# Altium schematic sheet elevator.SchDoc
size A2
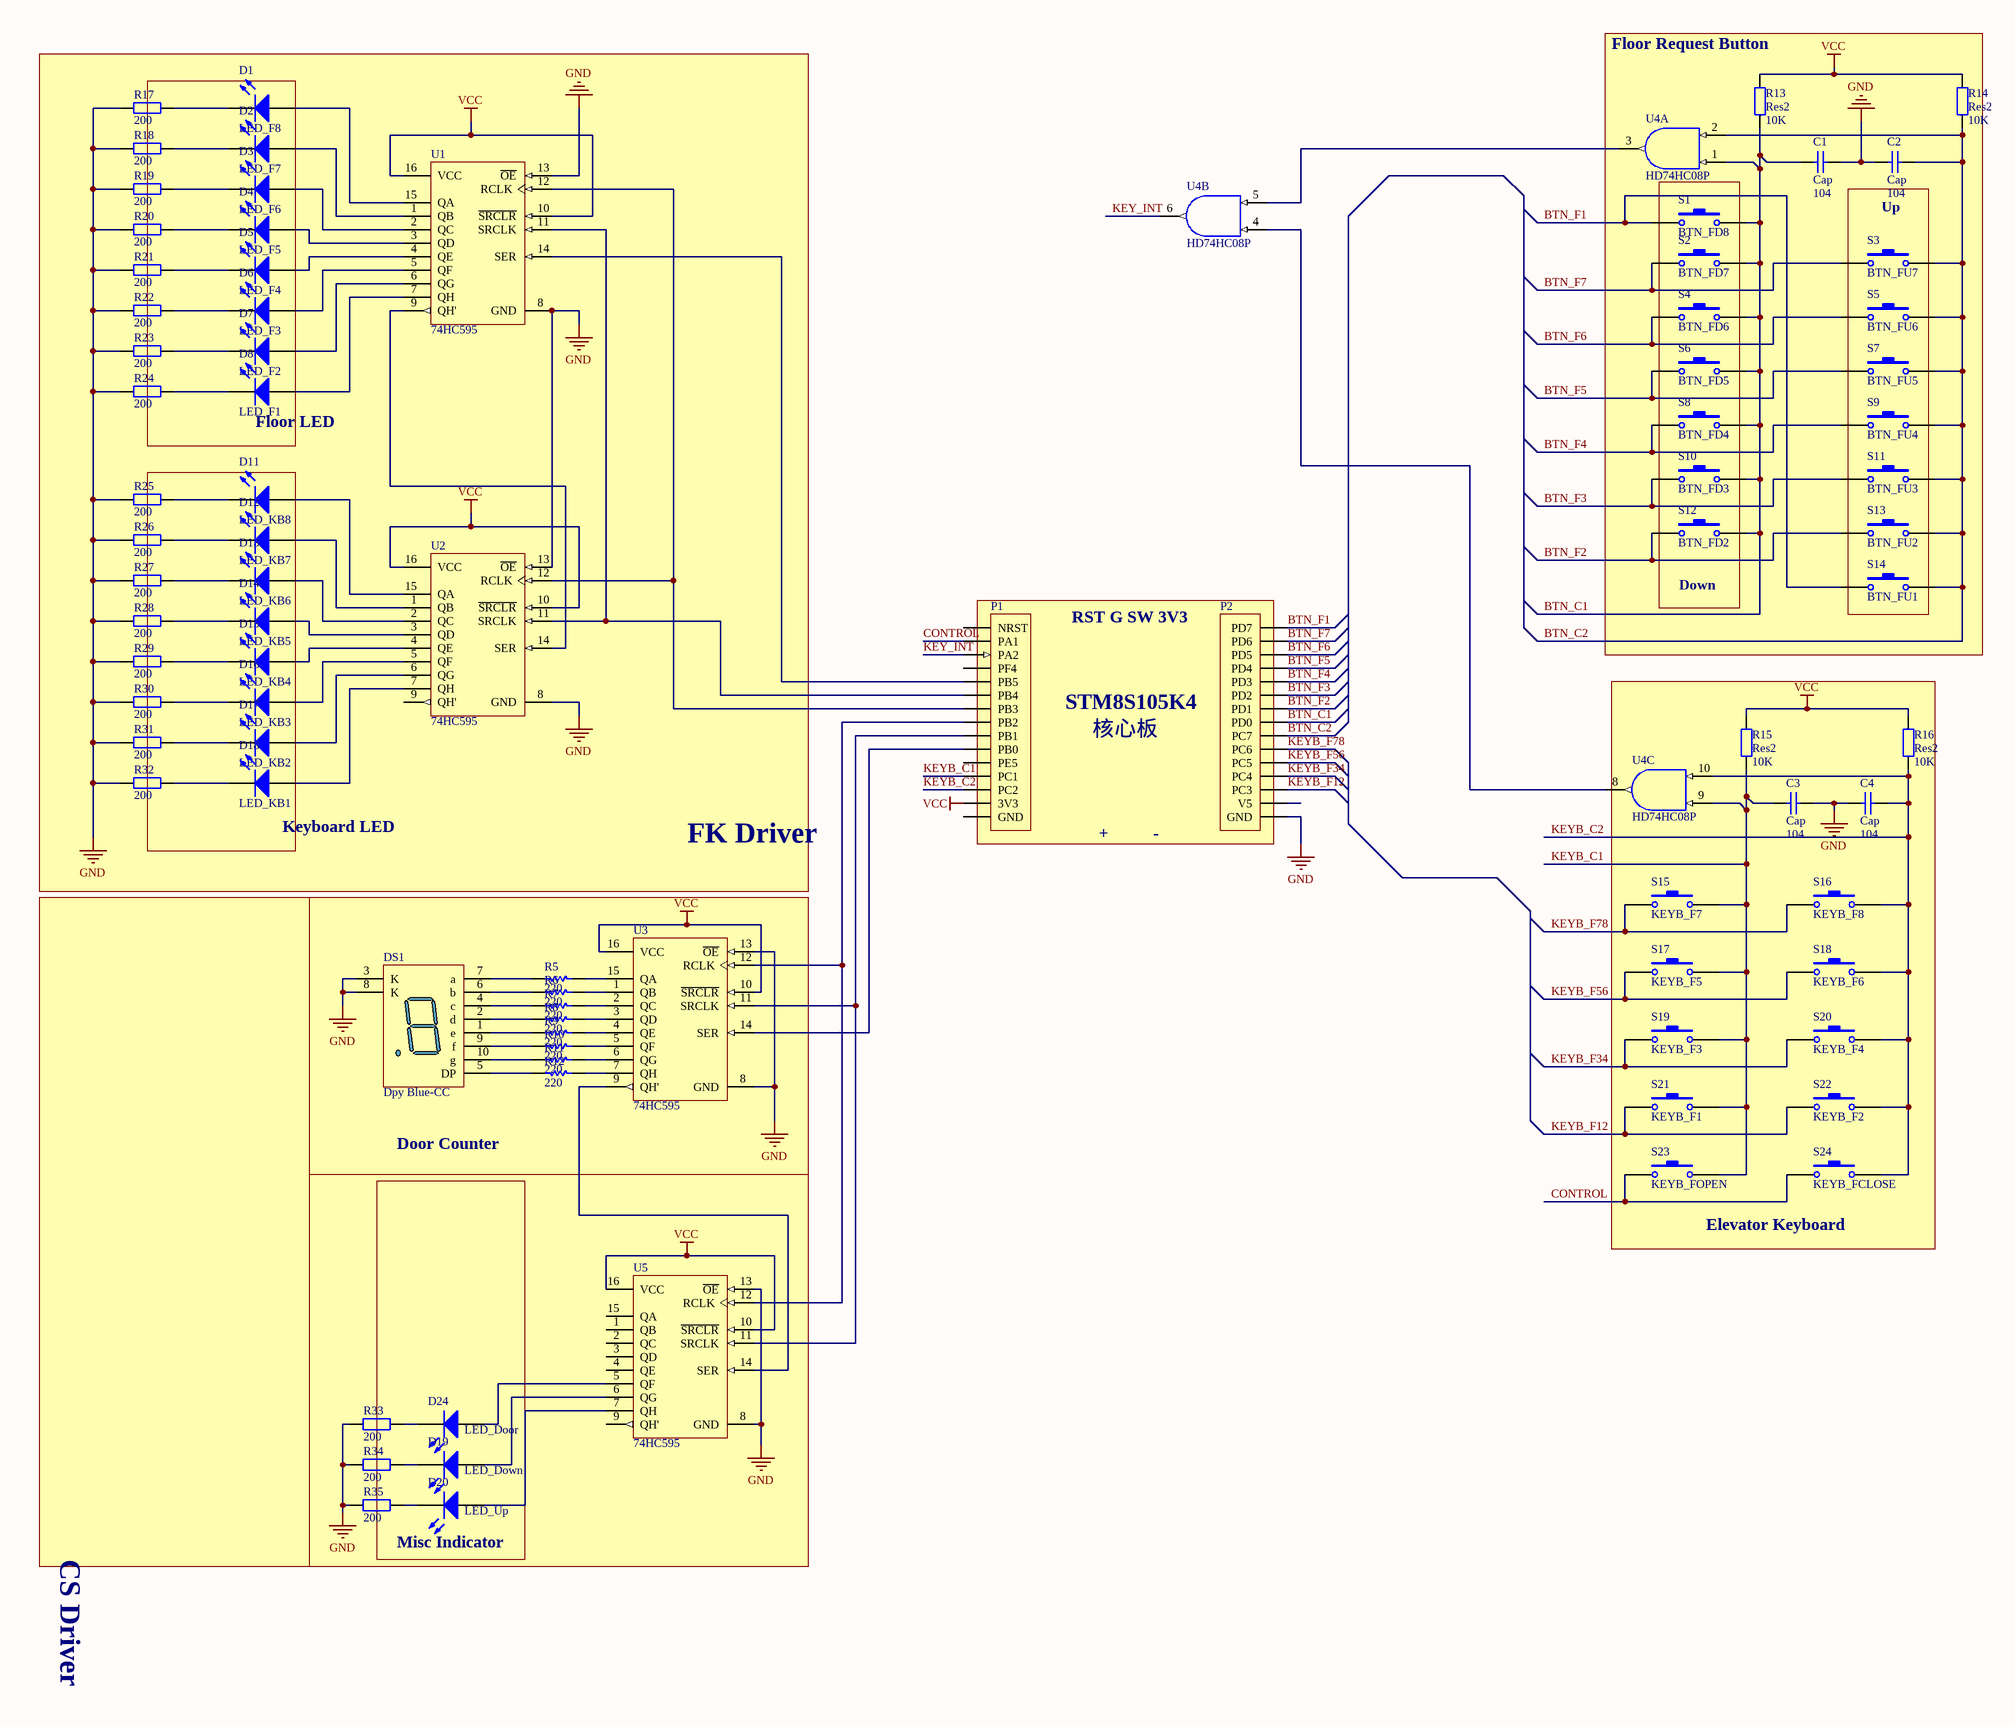
[diagram p0: elevator.SchDoc]

## Parts
C1  Cap  value 104  [RAD-0.3]
C2  Cap  value 104  [RAD-0.3]
C3  Cap  value 104  [RAD-0.3]
C4  Cap  value 104  [RAD-0.3]
D1  LED_F8  [LED-0]
D2  LED_F7  [LED-0]
D3  LED_F6  [LED-0]
D4  LED_F5  [LED-0]
D5  LED_F4  [LED-0]
D6  LED_F3  [LED-0]
D7  LED_F2  [LED-0]
D8  LED_F1  [LED-0]
D11  LED_KB8  [LED-0]
D12  LED_KB7  [LED-0]
D13  LED_KB6  [LED-0]
D14  LED_KB5  [LED-0]
D15  LED_KB4  [LED-0]
D16  LED_KB3  [LED-0]
D17  LED_KB2  [LED-0]
D18  LED_KB1  [LED-0]
D19  LED_Down  [LED-0]
D20  LED_Up  [LED-0]
D24  LED_Door  [LED-0]
DS1  Dpy Blue-CC  [H]
P1  (no value)  [HDR1X15H]
P2  (no value)  [HDR1X15H]
R5  value 220  [6-0805_N]  (hidden comment: Res1)
R6  value 220  [6-0805_N]  (hidden comment: Res1)
R7  value 220  [6-0805_N]  (hidden comment: Res1)
R8  value 220  [6-0805_N]  (hidden comment: Res1)
R9  value 220  [6-0805_N]  (hidden comment: Res1)
R10  value 220  [6-0805_N]  (hidden comment: Res1)
R11  value 220  [6-0805_N]  (hidden comment: Res1)
R12  value 220  [6-0805_N]  (hidden comment: Res1)
R13  Res2  value 10K  [AXIAL-0.4]
R14  Res2  value 10K  [AXIAL-0.4]
R15  Res2  value 10K  [AXIAL-0.4]
R16  Res2  value 10K  [AXIAL-0.4]
R17  value 200  [AXIAL-0.4]  (hidden comment: Res2)
R18  value 200  [AXIAL-0.4]  (hidden comment: Res2)
R19  value 200  [AXIAL-0.4]  (hidden comment: Res2)
R20  value 200  [AXIAL-0.4]  (hidden comment: Res2)
R21  value 200  [AXIAL-0.4]  (hidden comment: Res2)
R22  value 200  [AXIAL-0.4]  (hidden comment: Res2)
R23  value 200  [AXIAL-0.4]  (hidden comment: Res2)
R24  value 200  [AXIAL-0.4]  (hidden comment: Res2)
R25  value 200  [AXIAL-0.4]  (hidden comment: Res2)
R26  value 200  [AXIAL-0.4]  (hidden comment: Res2)
R27  value 200  [AXIAL-0.4]  (hidden comment: Res2)
R28  value 200  [AXIAL-0.4]  (hidden comment: Res2)
R29  value 200  [AXIAL-0.4]  (hidden comment: Res2)
R30  value 200  [AXIAL-0.4]  (hidden comment: Res2)
R31  value 200  [AXIAL-0.4]  (hidden comment: Res2)
R32  value 200  [AXIAL-0.4]  (hidden comment: Res2)
R33  value 200  [AXIAL-0.4]  (hidden comment: Res2)
R34  value 200  [AXIAL-0.4]  (hidden comment: Res2)
R35  value 200  [AXIAL-0.4]  (hidden comment: Res2)
S1  BTN_FD8  [SPST-2]
S2  BTN_FD7  [SPST-2]
S3  BTN_FU7  [SPST-2]
S4  BTN_FD6  [SPST-2]
S5  BTN_FU6  [SPST-2]
S6  BTN_FD5  [SPST-2]
S7  BTN_FU5  [SPST-2]
S8  BTN_FD4  [SPST-2]
S9  BTN_FU4  [SPST-2]
S10  BTN_FD3  [SPST-2]
S11  BTN_FU3  [SPST-2]
S12  BTN_FD2  [SPST-2]
S13  BTN_FU2  [SPST-2]
S14  BTN_FU1  [SPST-2]
S15  KEYB_F7  [SPST-2]
S16  KEYB_F8  [SPST-2]
S17  KEYB_F5  [SPST-2]
S18  KEYB_F6  [SPST-2]
S19  KEYB_F3  [SPST-2]
S20  KEYB_F4  [SPST-2]
S21  KEYB_F1  [SPST-2]
S22  KEYB_F2  [SPST-2]
S23  KEYB_FOPEN  [SPST-2]
S24  KEYB_FCLOSE  [SPST-2]
U1  74HC595  [DIP-16]
U2  74HC595  [DIP-16]
U3  74HC595  [DIP-16]
U4  HD74HC08P  [PRDP0014AB-B]  (parts A,B,C of 4)
U5  74HC595  [DIP-16]

## Blocks framed on the sheet
FK Driver: U1 U2
Floor Request Button: C1 C2 R13 R14 U4
Floor LED: D1-D8 R17-R24
Down: S1 S2 S4 S6 S8 S10 S12
Up: S3 S5 S7 S9 S11 S13 S14
Keyboard LED: D11-D18 R25-R32
Elevator Keyboard: C3 C4 R15 R16 S15-S24 U4
CS Driver: U5
Door Counter: DS1 R5-R12 U3
Misc Indicator: D19 D20 D24 R33-R35

## Nets
GND: C1.2 C2.2 C3.2 C4.2 DS1.3(K) DS1.8(K) P2.15(GND) R17.1 R18.1 R19.1 R20.1 R21.1 R22.1 R23.1 R24.1 R25.1 R26.1 R27.1 R28.1 R29.1 R30.1 R31.1 R32.1 R33.1 R34.1 R35.1 U1.8(GND) U1.13(~{OE}) U2.8(GND) U2.13(~{OE}) U3.8(GND) U3.13(~{OE}) U5.8(GND) U5.13(~{OE})
VCC: P1.14(3V3) R13.2 R14.2 R15.2 R16.2 U1.10(~{SRCLR}) U1.16(VCC) U2.10(~{SRCLR}) U2.16(VCC) U3.10(~{SRCLR}) U3.16(VCC) U5.10(~{SRCLR}) U5.16(VCC)
BTN_C1: C1.1 P2.8(PD0) R13.1 S1.2 S2.2 S4.2 S6.2 S8.2 S10.2 S12.2 U4.1(1A)
BTN_C2: C2.1 P2.9(PC7) R14.1 S3.2 S5.2 S7.2 S9.2 S11.2 S13.2 S14.2 U4.2(1B)
BTN_F1: P2.1(PD7) S1.1 S14.1
BTN_F2: P2.7(PD1) S12.1 S13.1
BTN_F3: P2.6(PD2) S10.1 S11.1
BTN_F4: P2.5(PD3) S8.1 S9.1
BTN_F5: P2.4(PD4) S6.1 S7.1
BTN_F6: P2.3(PD5) S4.1 S5.1
BTN_F7: P2.2(PD6) S2.1 S3.1
CONTROL: P1.2(PA1) S23.1 S24.1
KEY_INT: P1.3(PA2) U4.6(2Y)
KEYB_C1: C3.1 P1.12(PC1) R15.1 S15.2 S17.2 S19.2 S21.2 S23.2 U4.9(3A)
KEYB_C2: C4.1 P1.13(PC2) R16.1 S16.2 S18.2 S20.2 S22.2 S24.2 U4.10(3B)
KEYB_F12: P2.13(PC3) S21.1 S22.1
KEYB_F34: P2.12(PC4) S19.1 S20.1
KEYB_F56: P2.11(PC5) S17.1 S18.1
KEYB_F78: P2.10(PC6) S15.1 S16.1
NetD1_1: D1.1(A) U1.15(QA)
NetD1_2: D1.2(K) R17.2
NetD2_1: D2.1(A) U1.1(QB)
NetD2_2: D2.2(K) R18.2
NetD3_1: D3.1(A) U1.2(QC)
NetD3_2: D3.2(K) R19.2
NetD4_1: D4.1(A) U1.3(QD)
NetD4_2: D4.2(K) R20.2
NetD5_1: D5.1(A) U1.4(QE)
NetD5_2: D5.2(K) R21.2
NetD6_1: D6.1(A) U1.5(QF)
NetD6_2: D6.2(K) R22.2
NetD7_1: D7.1(A) U1.6(QG)
NetD7_2: D7.2(K) R23.2
NetD8_1: D8.1(A) U1.7(QH)
NetD8_2: D8.2(K) R24.2
NetD11_1: D11.1(A) U2.15(QA)
NetD11_2: D11.2(K) R25.2
NetD12_1: D12.1(A) U2.1(QB)
NetD12_2: D12.2(K) R26.2
NetD13_1: D13.1(A) U2.2(QC)
NetD13_2: D13.2(K) R27.2
NetD14_1: D14.1(A) U2.3(QD)
NetD14_2: D14.2(K) R28.2
NetD15_1: D15.1(A) U2.4(QE)
NetD15_2: D15.2(K) R29.2
NetD16_1: D16.1(A) U2.5(QF)
NetD16_2: D16.2(K) R30.2
NetD17_1: D17.1(A) U2.6(QG)
NetD17_2: D17.2(K) R31.2
NetD18_1: D18.1(A) U2.7(QH)
NetD18_2: D18.2(K) R32.2
NetD19_1: D19.1(A) U5.6(QG)
NetD19_2: D19.2(K) R34.2
NetD20_1: D20.1(A) U5.7(QH)
NetD20_2: D20.2(K) R35.2
NetD24_1: D24.1(A) U5.5(QF)
NetD24_2: D24.2(K) R33.2
NetDS1_1: DS1.1(e) R9.2
NetDS1_2: DS1.2(d) R8.2
NetDS1_4: DS1.4(c) R7.2
NetDS1_5: DS1.5(DP) R12.2
NetDS1_6: DS1.6(b) R6.2
NetDS1_7: DS1.7(a) R5.2
NetDS1_9: DS1.9(f) R10.2
NetDS1_10: DS1.10(g) R11.2
NetP1_5: P1.5(PB5) U1.14(SER)
NetP1_6: P1.6(PB4) U1.11(SRCLK) U2.11(SRCLK)
NetP1_7: P1.7(PB3) U1.12(RCLK) U2.12(RCLK)
NetP1_8: P1.8(PB2) U3.12(RCLK) U5.12(RCLK)
NetP1_9: P1.9(PB1) U3.11(SRCLK) U5.11(SRCLK)
NetP1_10: P1.10(PB0) U3.14(SER)
NetR5_1: R5.1 U3.15(QA)
NetR6_1: R6.1 U3.1(QB)
NetR7_1: R7.1 U3.2(QC)
NetR8_1: R8.1 U3.3(QD)
NetR9_1: R9.1 U3.4(QE)
NetR10_1: R10.1 U3.5(QF)
NetR11_1: R11.1 U3.6(QG)
NetR12_1: R12.1 U3.7(QH)
NetU1_9: U1.9(QH') U2.14(SER)
NetU3_9: U3.9(QH') U5.14(SER)
NetU4_3: U4.3(1Y) U4.5(2B)
NetU4_4: U4.4(2A) U4.8(3Y)

Not connected (* = marked no-connect by the designer): P1 1(NRST) 4(PF4) 11(PE5) 15(GND); P2 14(V5); U2 9(QH'); U4 7(GND) 14(VCC); U5 1(QB) 2(QC) 3(QD) 4(QE) 9(QH') 15(QA)

## Notes on the sheet
- RST G SW 3V3
- STM8S105K4
- 核心板
- +          -

## Library data of the parts
C1-C4 = Cap: Capacitor; Published: 8-Jun-2000; LatestRevisionDate: 17-Jul-2002; LatestRevisionNote: Re-released for DXP Platform.; PackageReference: RAD-0.3; Publisher: Altium Limited; PackageDescription: Radial Cap, Thru-Hole; 2 Leads; 0.3 in Pin Spacing
D1-D8 D11-D20 D24 = LED0: Typical INFRARED GaAs LED; Published: 8-Jun-2000; LatestRevisionDate: 08-Jul-2005; LatestRevisionNote: Mech Layer 1 removed.; PackageReference: LED-0; Publisher: Altium Limited; PackageDescription: LED; 2 Leads
DS1 = Dpy Blue-CC: 14.2 mm General Purpose Blue 7-Segment Display: CC, RH DP, Gray Surface; MinimumIntensity: 2020 ucd; Note: IF = 10 mA; Published: 8-Jun-2000; LatestRevisionDate: 17-Dec-2003; LatestRevisionNote: Schematic revised, PCB Footprint replaced.; DatasheetVersion: 24-Sep-2002; PackageVersion: 24-Sep-2002; PackageReference: H; Publisher: Altium Limited; PackageDescription: LED, 7-Segment Display, 14.2 mm, RHD; 10 Leads; Row Space 15.24 mm; Pitch 2.54 mm; Colour: Blue; ComponentLink1Description: Manufacturer Link; ComponentLink1URL: http://www.agilent.com/
P1 P2 = Header 15H: Header, 15-Pin, Right Angle; LatestRevisionDate: 17-Jul-2002; LatestRevisionNote: Re-released for DXP Platform.; Publisher: Altium Limited
R5-R12 = Res1: Resistor; Published: 8-Jun-2000; LatestRevisionDate: 17-Jul-2002; LatestRevisionNote: Re-released for DXP Platform.; PackageReference: AXIAL-0.3; Publisher: Altium Limited; PackageDescription: Axial Device, Thru-Hole; 2 Leads; 0.3 in Pin Spacing
R13-R35 = Res2: Resistor; Published: 8-Jun-2000; LatestRevisionDate: 17-Jul-2002; LatestRevisionNote: Re-released for DXP Platform.; PackageReference: AXIAL-0.4; Publisher: Altium Limited; PackageDescription: Axial Device, Thru-Hole; 2 Leads; 0.4 in Pin Spacing
S1-S24 = SW-PB: Switch; Published: 24-Mar-1999; LatestRevisionDate: 17-Jul-2002; LatestRevisionNote: Re-released for DXP Platform.; PackageReference: SPST-2; Publisher: Altium Limited; PackageDescription: Switch; 2 Leads
U1-U3 U5 = M74HC595B1R: 8 Bit Shift Register with Output Latches (3 STATE); Published: 8-Jun-2000; LatestRevisionDate: 06-Jun-2005; LatestRevisionNote: Stylized 3D Model Added.; DatasheetVersion: Apr-1993; PackageVersion: Apr-1996; PackageReference: DIP16; Publisher: Altium Limited; PackageDescription: DIP; 16 Leads; Row Spacing 7.62 mm; Pitch 2.54 mm; ComponentLink1Description: Manufacturer Link; ComponentLink1URL: http://www.st.com/; ComponentLink2Description: Datasheet; ComponentLink2URL: http://www.st.com/stonline/products/literature/ds/1989/m74hc595.pdf
U4 = HD74HC08P: Quad 2-Input AND Gates; Published: 10-Feb-2010; DatasheetVersion: Rev.2.00, Oct-2005; PackageVersion: Sep-2005; PackageReference: PRDP0014AB-B; Publisher: Altium Limited; PackageDescription: 14-Pin Plastic DIP, 19.2 x 6.3 mm Body, 7.62 mm Row Spacing, Pitch 2.54 mm; Code_JEITA: P-DIP14-6.3x19.2-2.54; ComponentLink1Description: Manufacturer Link; ComponentLink1URL: http://sg.renesas.com/fmwk.jsp?cnt=hd74hc_root.jsp&fp=/products/standard_ic/general_purpose_logic/5v_standard_logic/hd74hc/; ComponentLink2Description: Datasheet; ComponentLink2URL: http://documentation.renesas.com/eng/products/logic/rej03d0536_hd74hc08ds.pdf; ComponentLink3Description: Packaging Specification; ComponentLink3URL: http://sg.renesas.com/media/products/common_info/package/pdf/ic/code/prdp0014ab_b.pdf